# Altium schematic sheet schematic.SchDoc: <Project Name>
size A2; ENG_APP_DATE: --/--/--; DSN_APP_DATE: --/--/--; CHK_APP_DATE: --/--/--; Engineer: Engineer; Address4: Thành phố Hồ Chí Minh; DocumentNumber: 1; Revision: 1.0; SheetNumber: 1; SheetTotal: 1
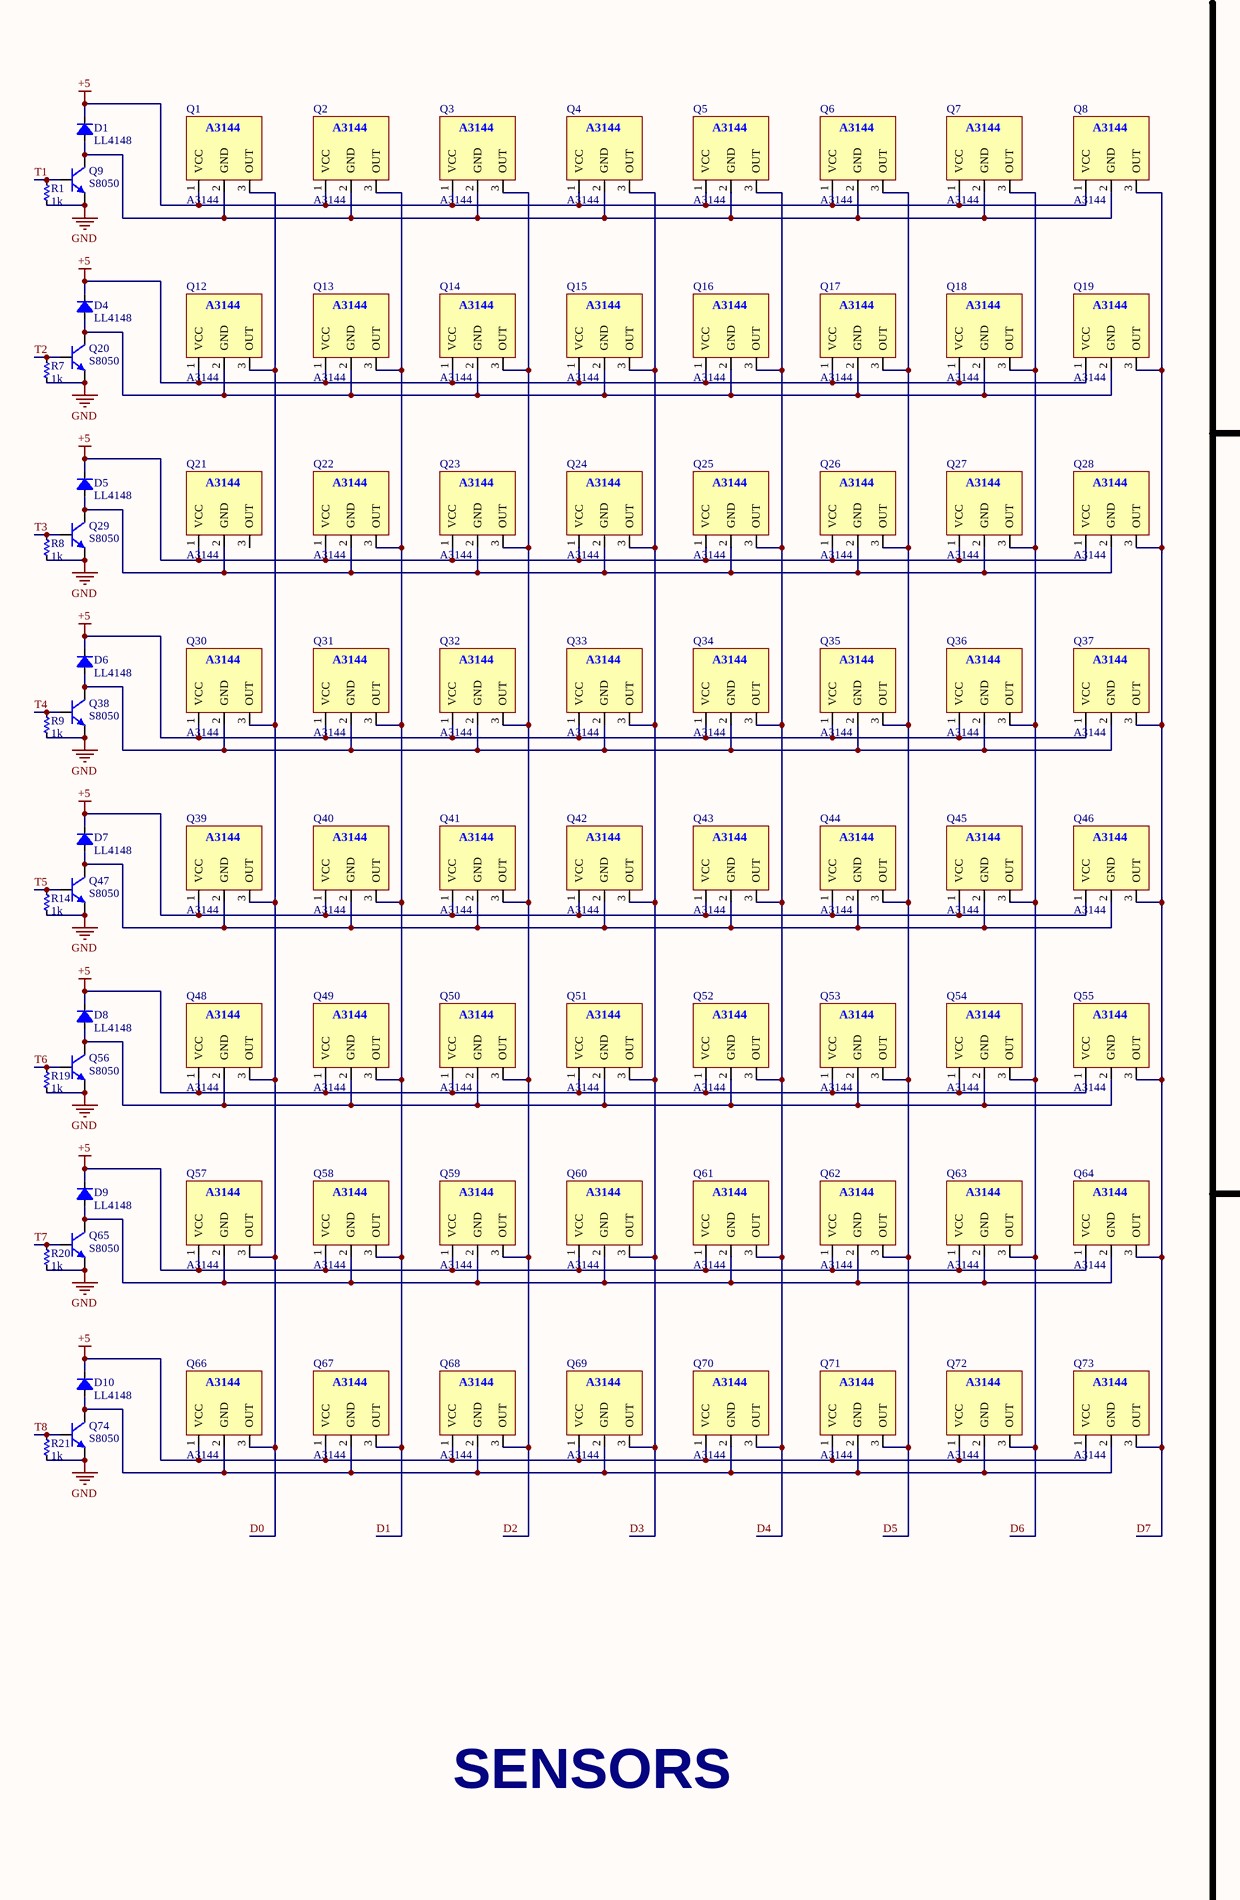
[diagram p0: schematic.SchDoc, left]
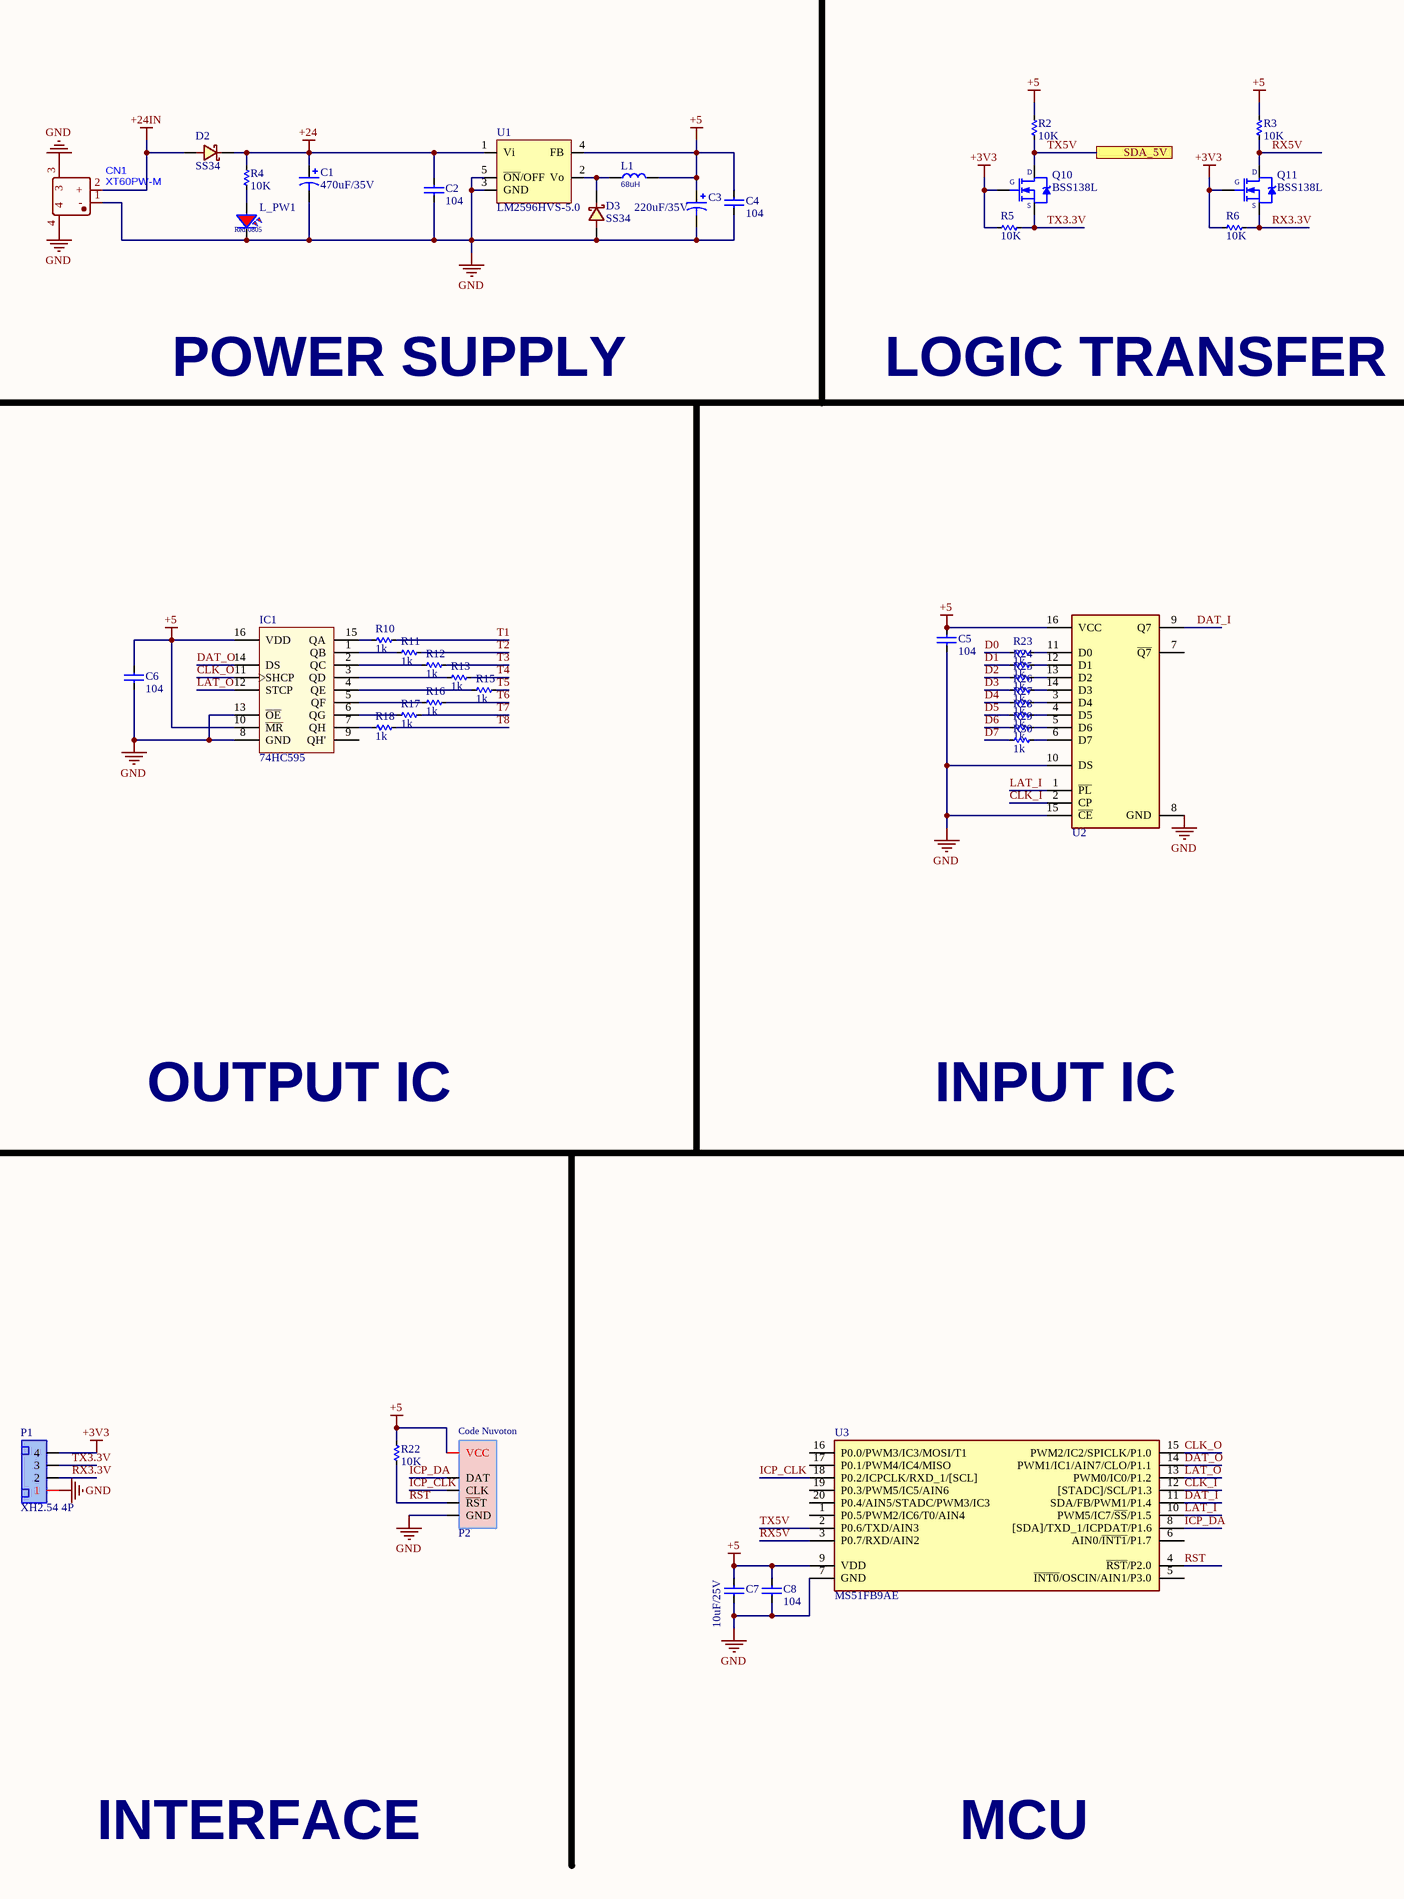
[diagram p1: schematic.SchDoc, right]

## Parts
C1  470uF/35V  [C8X12mm]
C2  104  [C_0805_SMD]
C3  220uF/35V  [C8X12mm]
C4  104  [C_0805_SMD]
C5  104  [C_0805_SMD]
C6  104  [C_0805_SMD]
C7  10uF/25V  [C_0805_SMD]
C8  104  [C_0805_SMD]
CN1  XT60PW-M  [CONN-TH_XT60PW-M]
D1  LL4148  [SOD80C_MFG]
D2  SS34  [D_SMA]
D3  SS34  [D_SMA]
D4  LL4148  [SOD80C_MFG]
D5  LL4148  [SOD80C_MFG]
D6  LL4148  [SOD80C_MFG]
D7  LL4148  [SOD80C_MFG]
D8  LL4148  [SOD80C_MFG]
D9  LL4148  [SOD80C_MFG]
D10  LL4148  [SOD80C_MFG]
IC1  74HC595  [SO_16]
L1  68uH  [CDRH127]
L_PW1  LED RED  [LED 0805 Red]  (value not drawn)
P1  XH2.54 4P  [XH2.54_4P_RA]
P2  Nuvoton  [Header Code Nuvoton 2.54 6P]  (value not drawn)  (no BOM)
Q1  A3144  [QTO-92]
Q2  A3144  [QTO-92]
Q3  A3144  [QTO-92]
Q4  A3144  [QTO-92]
Q5  A3144  [QTO-92]
Q6  A3144  [QTO-92]
Q7  A3144  [QTO-92]
Q8  A3144  [QTO-92]
Q9  S8050  [SOT23_N NXP]
Q10  BSS138L  [SOT23_N NXP]
Q11  BSS138L  [SOT23_N NXP]
Q12  A3144  [QTO-92]
Q13  A3144  [QTO-92]
Q14  A3144  [QTO-92]
Q15  A3144  [QTO-92]
Q16  A3144  [QTO-92]
Q17  A3144  [QTO-92]
Q18  A3144  [QTO-92]
Q19  A3144  [QTO-92]
Q20  S8050  [SOT23_N NXP]
Q21  A3144  [QTO-92]
Q22  A3144  [QTO-92]
Q23  A3144  [QTO-92]
Q24  A3144  [QTO-92]
Q25  A3144  [QTO-92]
Q26  A3144  [QTO-92]
Q27  A3144  [QTO-92]
Q28  A3144  [QTO-92]
Q29  S8050  [SOT23_N NXP]
Q30  A3144  [QTO-92]
Q31  A3144  [QTO-92]
Q32  A3144  [QTO-92]
Q33  A3144  [QTO-92]
Q34  A3144  [QTO-92]
Q35  A3144  [QTO-92]
Q36  A3144  [QTO-92]
Q37  A3144  [QTO-92]
Q38  S8050  [SOT23_N NXP]
Q39  A3144  [QTO-92]
Q40  A3144  [QTO-92]
Q41  A3144  [QTO-92]
Q42  A3144  [QTO-92]
Q43  A3144  [QTO-92]
Q44  A3144  [QTO-92]
Q45  A3144  [QTO-92]
Q46  A3144  [QTO-92]
Q47  S8050  [SOT23_N NXP]
Q48  A3144  [QTO-92]
Q49  A3144  [QTO-92]
Q50  A3144  [QTO-92]
Q51  A3144  [QTO-92]
Q52  A3144  [QTO-92]
Q53  A3144  [QTO-92]
Q54  A3144  [QTO-92]
Q55  A3144  [QTO-92]
Q56  S8050  [SOT23_N NXP]
Q57  A3144  [QTO-92]
Q58  A3144  [QTO-92]
Q59  A3144  [QTO-92]
Q60  A3144  [QTO-92]
Q61  A3144  [QTO-92]
Q62  A3144  [QTO-92]
Q63  A3144  [QTO-92]
Q64  A3144  [QTO-92]
Q65  S8050  [SOT23_N NXP]
Q66  A3144  [QTO-92]
Q67  A3144  [QTO-92]
Q68  A3144  [QTO-92]
Q69  A3144  [QTO-92]
Q70  A3144  [QTO-92]
Q71  A3144  [QTO-92]
Q72  A3144  [QTO-92]
Q73  A3144  [QTO-92]
Q74  S8050  [SOT23_N NXP]
R1  1k  [RES-SMD-0805]
R2  10K  [RES-SMD-0805]
R3  10K  [RES-SMD-0805]
R4  10K  [RES-SMD-0805]
R5  10K  [RES-SMD-0805]
R6  10K  [RES-SMD-0805]
R7  1k  [RES-SMD-0805]
R8  1k  [RES-SMD-0805]
R9  1k  [RES-SMD-0805]
R10  1k  [RES-SMD-0805]
R11  1k  [RES-SMD-0805]
R12  1k  [RES-SMD-0805]
R13  1k  [RES-SMD-0805]
R14  1k  [RES-SMD-0805]
R15  1k  [RES-SMD-0805]
R16  1k  [RES-SMD-0805]
R17  1k  [RES-SMD-0805]
R18  1k  [RES-SMD-0805]
R19  1k  [RES-SMD-0805]
R20  1k  [RES-SMD-0805]
R21  1k  [RES-SMD-0805]
R22  10K  [RES-SMD-0805]
R23  1k  [RES-SMD-0805]
R24  1k  [RES-SMD-0805]
R25  1k  [RES-SMD-0805]
R26  1k  [RES-SMD-0805]
R27  1k  [RES-SMD-0805]
R28  1k  [RES-SMD-0805]
R29  1k  [RES-SMD-0805]
R30  1k  [RES-SMD-0805]
U1  LM2596HVS-5.0  [TO-263-5]
U2  74HC165  [SO_16]  (value not drawn)
U3  MS51FB9AE  [SOG65_20]

## Ports
SDA_5V

## Nets
+3V3: P1.4 Q10.1(G) Q11.1(G) R5.2 R6.2
+5: C3.1 C4.2 C5.2 C6.2 C7.1 C8.1 D1.1 D4.1 D5.1 D6.1 D7.1 D8.1 D9.1 D10.1 IC1.10(~{MR}) IC1.16(VDD) L1.2 P2.1(VCC) Q1.1(VCC) Q2.1(VCC) Q3.1(VCC) Q4.1(VCC) Q5.1(VCC) Q6.1(VCC) Q7.1(VCC) Q8.1(VCC) Q12.1(VCC) Q13.1(VCC) Q14.1(VCC) Q15.1(VCC) Q16.1(VCC) Q17.1(VCC) Q18.1(VCC) Q19.1(VCC) Q21.1(VCC) Q22.1(VCC) Q23.1(VCC) Q24.1(VCC) Q25.1(VCC) Q26.1(VCC) Q27.1(VCC) Q28.1(VCC) Q30.1(VCC) Q31.1(VCC) Q32.1(VCC) Q33.1(VCC) Q34.1(VCC) Q35.1(VCC) Q36.1(VCC) Q37.1(VCC) Q39.1(VCC) Q40.1(VCC) Q41.1(VCC) Q42.1(VCC) Q43.1(VCC) Q44.1(VCC) Q45.1(VCC) Q46.1(VCC) Q48.1(VCC) Q49.1(VCC) Q50.1(VCC) Q51.1(VCC) Q52.1(VCC) Q53.1(VCC) Q54.1(VCC) Q55.1(VCC) Q57.1(VCC) Q58.1(VCC) Q59.1(VCC) Q60.1(VCC) Q61.1(VCC) Q62.1(VCC) Q63.1(VCC) Q64.1(VCC) Q66.1(VCC) Q67.1(VCC) Q68.1(VCC) Q69.1(VCC) Q70.1(VCC) Q71.1(VCC) Q72.1(VCC) Q73.1(VCC) R2.2 R3.2 R22.1 U1.4(FB) U2.16(VCC) U3.9(VDD)
+24: C1.1 C2.2 D2.2(K) R4.1 U1.1(Vi)
+24IN: CN1.2(+) D2.1(A)
GND: C1.2 C2.1 C3.2 C4.1 C5.1 C6.1 C7.2 C8.2 CN1.1(-) CN1.3 CN1.4 D3.1(A) IC1.8(GND) IC1.13(~{OE}) L_PW1.2 P1.1 P2.6(GND) Q9.2(E) Q20.2(E) Q29.2(E) Q38.2(E) Q47.2(E) Q56.2(E) Q65.2(E) Q74.2(E) R1.2 R7.2 R8.2 R9.2 R14.2 R19.2 R20.2 R21.2 U1.3(GND) U1.5(~{ON}/OFF) U2.8(GND) U2.10(DS) U2.15(~{CE}) U3.7(GND)
CLK_I: U2.2(CP) U3.12([STADC]/SCL/P1.3)
CLK_O: IC1.11(SHCP) U3.15(PWM2/IC2/SPICLK/P1.0)
D0: Q1.3(OUT) Q12.3(OUT) Q30.3(OUT) Q39.3(OUT) Q48.3(OUT) Q57.3(OUT) Q66.3(OUT) R23.2
D1: Q2.3(OUT) Q13.3(OUT) Q22.3(OUT) Q31.3(OUT) Q40.3(OUT) Q49.3(OUT) Q58.3(OUT) Q67.3(OUT) R24.2
D2: Q3.3(OUT) Q14.3(OUT) Q23.3(OUT) Q32.3(OUT) Q41.3(OUT) Q50.3(OUT) Q59.3(OUT) Q68.3(OUT) R25.2
D3: Q4.3(OUT) Q15.3(OUT) Q24.3(OUT) Q33.3(OUT) Q42.3(OUT) Q51.3(OUT) Q60.3(OUT) Q69.3(OUT) R26.2
D4: Q5.3(OUT) Q16.3(OUT) Q25.3(OUT) Q34.3(OUT) Q43.3(OUT) Q52.3(OUT) Q61.3(OUT) Q70.3(OUT) R27.2
D5: Q6.3(OUT) Q17.3(OUT) Q26.3(OUT) Q35.3(OUT) Q44.3(OUT) Q53.3(OUT) Q62.3(OUT) Q71.3(OUT) R28.2
D6: Q7.3(OUT) Q18.3(OUT) Q27.3(OUT) Q36.3(OUT) Q45.3(OUT) Q54.3(OUT) Q63.3(OUT) Q72.3(OUT) R29.2
D7: Q8.3(OUT) Q19.3(OUT) Q28.3(OUT) Q37.3(OUT) Q46.3(OUT) Q55.3(OUT) Q64.3(OUT) Q73.3(OUT) R30.2
DAT_I: U2.9(Q7) U3.11(SDA/FB/PWM1/P1.4)
DAT_O: IC1.14(DS) U3.14(PWM1/IC1/AIN7/CLO/P1.1)
ICP_CLK: P2.4(CLK) U3.18(P0.2/ICPCLK/RXD_1/[SCL])
ICP_DA: P2.3(DAT) U3.8([SDA]/TXD_1/ICPDAT/P1.6)
LAT_I: U2.1(~{PL}) U3.10(PWM5/IC7/~{SS}/P1.5)
LAT_O: IC1.12(STCP) U3.13(PWM0/IC0/P1.2)
RST: P2.5(~{RS}T) R22.2 U3.4(~{RST}/P2.0)
RX3.3V: P1.2 Q11.2(S) R6.1
RX5V: Q11.3(D) R3.1 U3.3(P0.7/RXD/AIN2)
T1: Q9.1(B) R1.1 R10.1
T2: Q20.1(B) R7.1 R11.1
T3: Q29.1(B) R8.1 R12.1
T4: Q38.1(B) R9.1 R13.1
T5: Q47.1(B) R14.1 R15.1
T6: Q56.1(B) R16.1 R19.1
T7: Q65.1(B) R17.1 R20.1
T8: Q74.1(B) R18.1 R21.1
TX3.3V: P1.3 Q10.2(S) R5.1
TX5V: Q10.3(D) R2.1 U3.2(P0.6/TXD/AIN3) ; port SDA_5V
NetD1_2: D1.2 Q1.2(GND) Q2.2(GND) Q3.2(GND) Q4.2(GND) Q5.2(GND) Q6.2(GND) Q7.2(GND) Q8.2(GND) Q9.3(C)
NetD3_2: D3.2(K) L1.1 U1.2(Vo)
NetD4_2: D4.2 Q12.2(GND) Q13.2(GND) Q14.2(GND) Q15.2(GND) Q16.2(GND) Q17.2(GND) Q18.2(GND) Q19.2(GND) Q20.3(C)
NetD5_2: D5.2 Q21.2(GND) Q22.2(GND) Q23.2(GND) Q24.2(GND) Q25.2(GND) Q26.2(GND) Q27.2(GND) Q28.2(GND) Q29.3(C)
NetD6_2: D6.2 Q30.2(GND) Q31.2(GND) Q32.2(GND) Q33.2(GND) Q34.2(GND) Q35.2(GND) Q36.2(GND) Q37.2(GND) Q38.3(C)
NetD7_2: D7.2 Q39.2(GND) Q40.2(GND) Q41.2(GND) Q42.2(GND) Q43.2(GND) Q44.2(GND) Q45.2(GND) Q46.2(GND) Q47.3(C)
NetD8_2: D8.2 Q48.2(GND) Q49.2(GND) Q50.2(GND) Q51.2(GND) Q52.2(GND) Q53.2(GND) Q54.2(GND) Q55.2(GND) Q56.3(C)
NetD9_2: D9.2 Q57.2(GND) Q58.2(GND) Q59.2(GND) Q60.2(GND) Q61.2(GND) Q62.2(GND) Q63.2(GND) Q64.2(GND) Q65.3(C)
NetD10_2: D10.2 Q66.2(GND) Q67.2(GND) Q68.2(GND) Q69.2(GND) Q70.2(GND) Q71.2(GND) Q72.2(GND) Q73.2(GND) Q74.3(C)
NetIC1_1: IC1.1(QB) R11.2
NetIC1_2: IC1.2(QC) R12.2
NetIC1_3: IC1.3(QD) R13.2
NetIC1_4: IC1.4(QE) R15.2
NetIC1_5: IC1.5(QF) R16.2
NetIC1_6: IC1.6(QG) R17.2
NetIC1_7: IC1.7(QH) R18.2
NetIC1_15: IC1.15(QA) R10.2
NetL_PW1_1: L_PW1.1 R4.2
NetR23_1: R23.1 U2.11(D0)
NetR24_1: R24.1 U2.12(D1)
NetR25_1: R25.1 U2.13(D2)
NetR26_1: R26.1 U2.14(D3)
NetR27_1: R27.1 U2.3(D4)
NetR28_1: R28.1 U2.4(D5)
NetR29_1: R29.1 U2.5(D6)
NetR30_1: R30.1 U2.6(D7)

Not connected (* = marked no-connect by the designer): IC1 9(QH'); Q21 3(OUT); U2 7(~{Q7}); U3 1(P0.5/PWM2/IC6/T0/AIN4) 5(~{INT0}/OSCIN/AIN1/P3.0) 6(AIN0/~{INT1}/P1.7) 16(P0.0/PWM3/IC3/MOSI/T1) 17(P0.1/PWM4/IC4/MISO) 19(P0.3/PWM5/IC5/AIN6) 20(P0.4/AIN5/STADC/PWM3/IC3)

## Notes on the sheet
- POWER SUPPLY
- LOGIC TRANSFER
- OUTPUT IC
- INPUT IC
- SENSORS
- INTERFACE
- MCU
- Title
- Size:
- Date:
- A4
- Number:
- Time:
- Revision:
- Sheet
- of
- File:
- (in symbol Header Code Nuvoton) Code Nuvoton
- (in symbol LED 0805 RED) Red; 0805

## Library data of the parts
C1 = Cap Pol 470uF/35V: Polarized Capacitor (Axial) 470uF 35V; Code: 1402-231
C2 C4-C6 C8 = Cap 0805 104 100nF: Cap SMD 0805 104-100nF-0.1uF 50V; Code: 1438-080
C3 = Cap Pol 220uF/35V: Polarized Capacitor (Axial) 220uF 35V; Code: 1402-228
C7 = Cap 0805 10uF 25V: Cap SMD 0805 10uF; Code: 1436-100
D1 D4-D10 = LL4148: 0.2A, 100V, SOD80; Code: 2001-012; Designed by: Nhox
D2 D3 = SS34-SMA: Surface-Mount Schottky Barrier Rectifier; Code: 2005-008
IC1 = 74HC595 SMD SO16: Shift Register Single 8-Bit Serial to Serial/Parallel 16-Pin SOIC T/R; Code: 5001-017; Designed by: nhox
L1 = IND CDRH127 1280-680 68uH: CDRH127 Cuộn Cảm Dán SMD 1280-680 68uH 3.2A; Code: 1522-003
L_PW1 = LED 0805 RED: LED 0805 SMD RED; Code: 8600-017; Designed by: TranLuyen
P1 = XH2.54_4P_RA: XH2.54 RA; Code: 3509-012
P2 = Header Code Nuvoton: Header 6-5Pin
Q1-Q8 Q12-Q19 Q21-Q28 Q30-Q37 Q39-Q46 Q48-Q55 Q57-Q64 Q66-Q73 = hall sensor A3144: Sensitive Hall Effect Switches for High-Temperature Operation 4.5-24V; Code: 6110-015; ComponentLink1Description: Datasheet; ComponentLink1URL: https://www.elecrow.com/download/A3141-2-3-4-Datasheet.pdf
Q9 Q20 Q29 Q38 Q47 Q56 Q65 Q74 = S8050 SOT-23: J3Y-NPN SMD Transistor SOT23; Code: 1701-070
Q10 Q11 = BSS138L SOT23: Power MOSFET 200 mA, 50V, N−Channel SOT23; Code: 1901-076; Value: BSS138L
R1 R7-R21 R23-R30 = Res 1k 0805: Resistor SMD 0805; Code: 1024-086
R2-R6 R22 = Res 10k 0805: Resistor SMD 0805; Code: 1024-111
U1 = LM2596HVS-5.0: Vin 4.5-40VDC, Vout 5VDC, Iout MAX 3A; Code: 5101-052
U2 = 74HC165-SOIC-16: IC Shift Register 1 Element 8 Bit, Complementary 16-SOIC; Code: 5001-007; Designed by: nhox
U3 = MS51FB9AE: MS51FB9AE, ROM 16KB, RAM 256B + 1KB, SPROM 128B, 1T 8051-based CMOS up to 24Mhz; Code: 7201-019; Designed by: Nhox